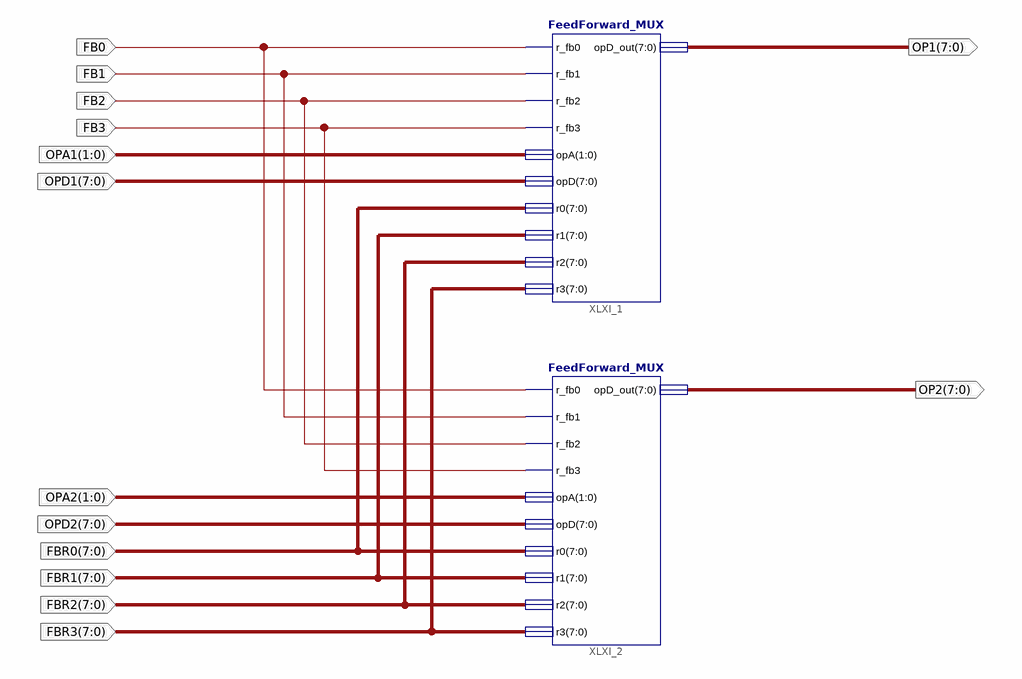
[diagram p0: schematic sheet 1]
// Xilinx ISE schematic FB_control.sch (spartan3) as structural Verilog: 2 symbols, 14 ports
module FB_control (
  input  FB0,
  input  FB1,
  input  FB2,
  input  FB3,
  input  [1:0] OPA1,
  input  [7:0] OPD1,
  input  [1:0] OPA2,
  input  [7:0] OPD2,
  input  [7:0] FBR0,
  input  [7:0] FBR1,
  input  [7:0] FBR2,
  input  [7:0] FBR3,
  output [7:0] OP1,
  output [7:0] OP2
);

  FeedForward_MUX XLXI_1 (
    .r_fb0(FB0), .r_fb1(FB1), .r_fb2(FB2), .r_fb3(FB3), .opA(OPA1), .opD(OPD1), .r0(FBR0), .r1(FBR1),
    .r2(FBR2), .r3(FBR3), .opD_out(OP1));
  FeedForward_MUX XLXI_2 (
    .r_fb0(FB0), .r_fb1(FB1), .r_fb2(FB2), .r_fb3(FB3), .opA(OPA2), .opD(OPD2), .r0(FBR0), .r1(FBR1),
    .r2(FBR2), .r3(FBR3), .opD_out(OP2));
endmodule
